# EAGLE schematic ioBoard (EAGLE 7.1.0)
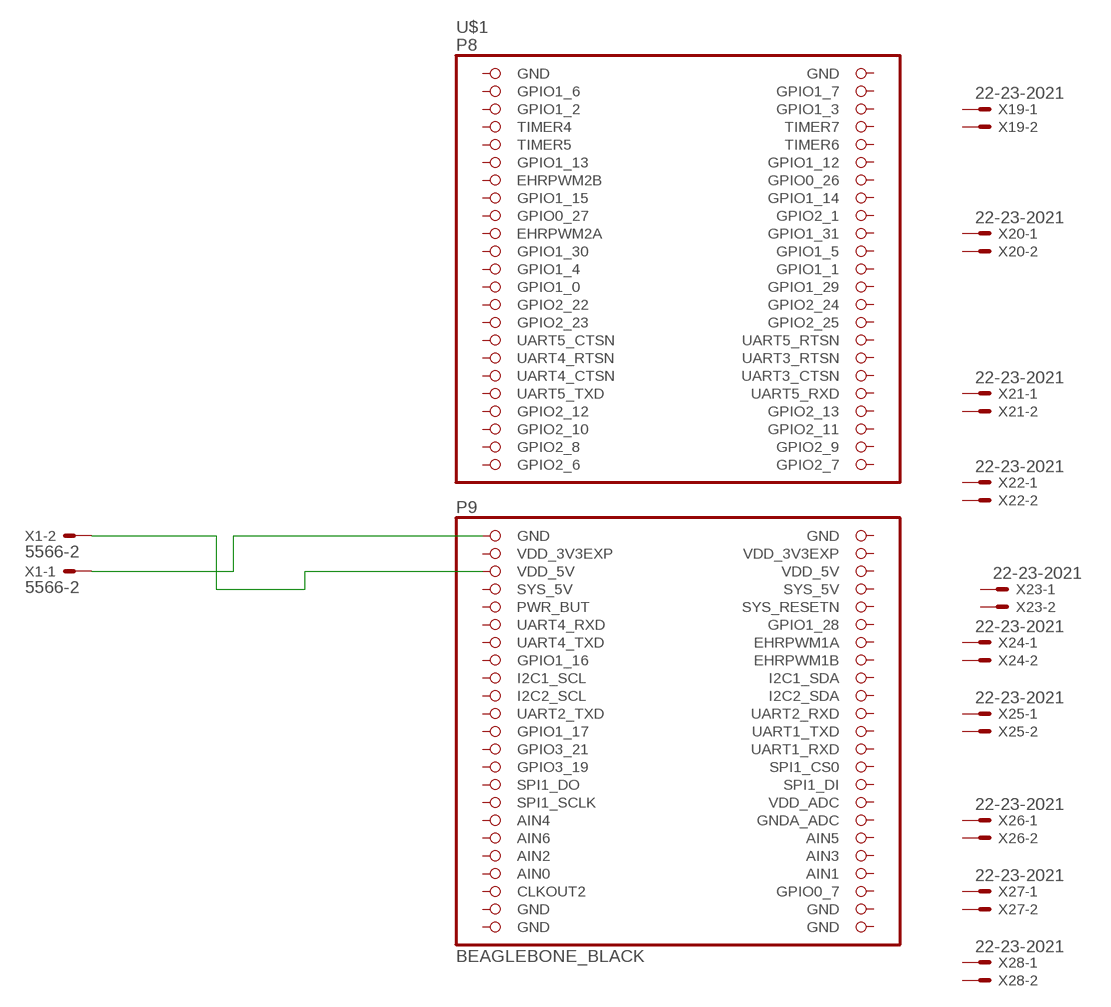
[diagram p0: schematic, sheet 1]

## Parts
U$1  BEAGLEBONE_BLACK  [BEAGEBONE]
X1  5566-2  [5566-2]
X19  22-23-2021  [22-23-2021]
X20  22-23-2021  [22-23-2021]
X21  22-23-2021  [22-23-2021]
X22  22-23-2021  [22-23-2021]
X23  22-23-2021  [22-23-2021]
X24  22-23-2021  [22-23-2021]
X25  22-23-2021  [22-23-2021]
X26  22-23-2021  [22-23-2021]
X27  22-23-2021  [22-23-2021]
X28  22-23-2021  [22-23-2021]

## Nets
N$1: U$1.184(GND) X1.1
N$2: U$1.180(VDD_5V) X1.2
Unconnected: U$1.93(GPIO2_7) U$1.94(GPIO2_6) U$1.95(GPIO2_9) U$1.96(GPIO2_8) U$1.97(GPIO2_11) U$1.98(GPIO2_10) U$1.99(GPIO2_13) U$1.100(GPIO2_12) U$1.101(UART5_RXD) U$1.102(UART5_TXD) U$1.103(UART3_CTSN) U$1.104(UART4_CTSN) U$1.105(UART3_RTSN) U$1.106(UART4_RTSN) U$1.107(UART5_RTSN) U$1.108(UART5_CTSN) U$1.109(GPIO2_25) U$1.110(GPIO2_23) U$1.111(GPIO2_24) U$1.112(GPIO2_22) U$1.113(GPIO1_29) U$1.114(GPIO1_0) U$1.115(GPIO1_1) U$1.116(GPIO1_4) U$1.117(GPIO1_5) U$1.118(GPIO1_30) U$1.119(GPIO1_31) U$1.120(EHRPWM2A) U$1.121(GPIO2_1) U$1.122(GPIO0_27) U$1.123(GPIO1_14) U$1.124(GPIO1_15) U$1.125(GPIO0_26) U$1.126(EHRPWM2B) U$1.127(GPIO1_12) U$1.128(GPIO1_13) U$1.129(TIMER6) U$1.130(TIMER5) U$1.131(TIMER7) U$1.132(TIMER4) U$1.133(GPIO1_3) U$1.134(GPIO1_2) U$1.135(GPIO1_7) U$1.136(GPIO1_6) U$1.143(GPIO0_7) U$1.144(CLKOUT2) U$1.145(AIN1) U$1.147(AIN3) U$1.148(AIN2) U$1.149(AIN5) U$1.150(AIN6) U$1.151(GNDA_ADC) U$1.152(AIN4) U$1.153(VDD_ADC) U$1.154(SPI1_SCLK) U$1.155(SPI1_DI) U$1.156(SPI1_DO) U$1.157(SPI1_CS0) U$1.158(GPIO3_19) U$1.159(UART1_RXD) U$1.160(GPIO3_21) U$1.161(UART1_TXD) U$1.162(GPIO1_17) U$1.163(UART2_RXD) U$1.164(UART2_TXD) U$1.165(I2C1_SDA) U$1.166(I2C2_SCL) U$1.167(I2C2_SDA) U$1.168(I2C1_SCL) U$1.169(EHRPWM1B) U$1.170(GPIO1_16) U$1.171(EHRPWM1A) U$1.172(UART4_TXD) U$1.173(GPIO1_28) U$1.174(UART4_RXD) U$1.175(SYS_RESETN) U$1.176(PWR_BUT) U$1.177(SYS_5V) X19.1 X19.2 X20.1 X20.2 X21.1 X21.2 X22.1 X22.2 X23.1 X23.2 X24.1 X24.2 X25.1 X25.2 X26.1 X26.2 X27.1 X27.2 X28.1 X28.2

## Power pins joined to a net without a drawn wire
AIN0: U$1.146(AIN0)
GND: U$1.137(GND) U$1.138(GND) U$1.139(GND) U$1.140(GND) U$1.141(GND) U$1.142(GND) U$1.183(GND)
SYS_5V: U$1.178(SYS_5V)
VDD_3V3EXP: U$1.181(VDD_3V3EXP) U$1.182(VDD_3V3EXP)
VDD_5V: U$1.179(VDD_5V)

## Library data of the parts
U$1 = BeagleBone:BEAGLEBONE_BLACK
X1 = con-molex:5566-2: Mini FIT connector 2 pol Source: http://www.molex.com; OC_FARNELL: 1822072; OC_NEWARK: unknown
X19-X28 = con-molex:22-23-2021: .100" (2.54mm) Center Header - 2 Pin; MF: MOLEX; MPN: 22-23-2021; OC_FARNELL: 1462926; OC_NEWARK: 25C3832